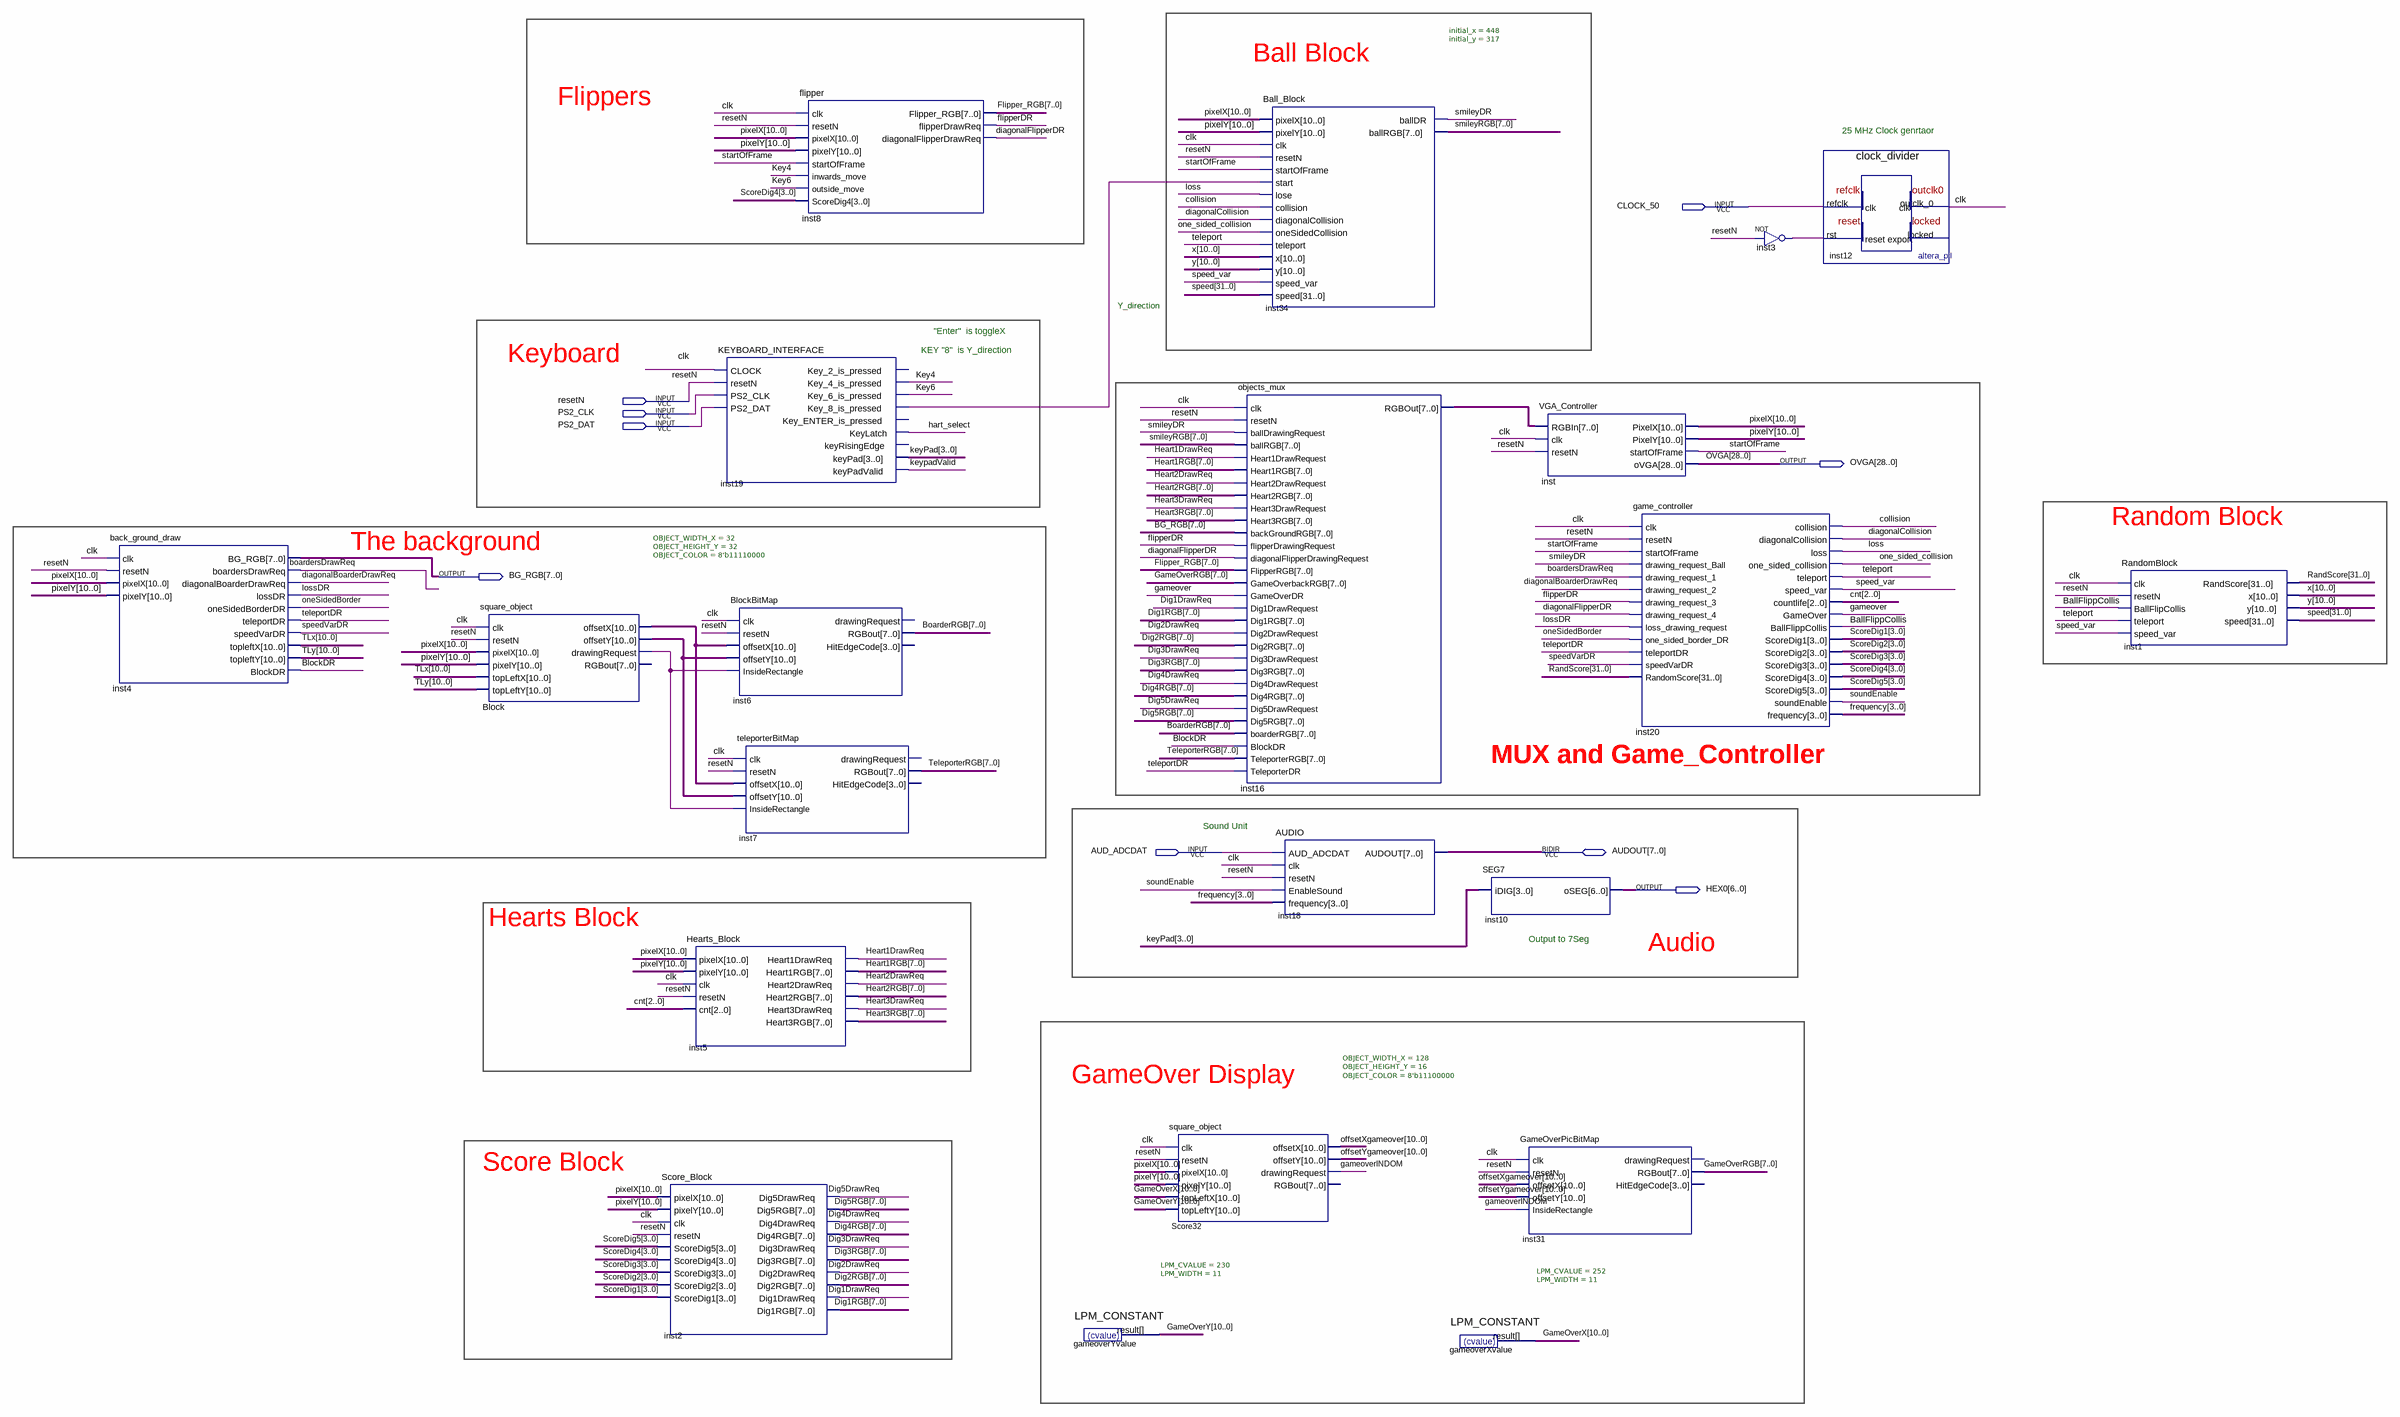
[diagram p0: schematic sheet]
// Quartus schematic TOP_VGA_DEMO_KBD.bdf as structural Verilog: 21 symbols, 9 pins
module TOP_VGA_DEMO_KBD (
  input  CLOCK_50,
  input  resetN,
  input  PS2_CLK,
  input  PS2_DAT,
  input  AUD_ADCDAT,
  inout  [7:0] AUDOUT,
  output [28:0] OVGA,
  output [7:0] BG_RGB,
  output [6:0] HEX0
);

  wire BallFlippCollis, Block_drawingrequest, BlockDR, boardersDrawReq, clk, collision,
       diagonalBoarderDrawReq, diagonalCollision, diagonalFlipperDR, Dig1DrawReq, Dig2DrawReq, Dig3DrawReq,
       Dig4DrawReq, Dig5DrawReq, flipperDR, gameover, gameoverINDOM, hart_select, Heart1DrawReq,
       Heart2DrawReq, Heart3DrawReq, inst3_out, inst19_key_8_is_pressed, Key4, Key6, keypadValid, loss,
       lossDR, one_sided_collision, oneSidedBorder, smileyDR, soundEnable, speed_var, speedVarDR,
       startOfFrame, teleport, teleportDR;
  wire [2:0] cnt;
  wire [3:0] frequency, keyPad, ScoreDig1, ScoreDig2, ScoreDig3, ScoreDig4, ScoreDig5;
  wire [7:0] BoarderRGB, Dig1RGB, Dig2RGB, Dig3RGB, Dig4RGB, Dig5RGB, Flipper_RGB, GameOverRGB, Heart1RGB,
       Heart2RGB, Heart3RGB, inst16_rgbout, smileyRGB, TeleporterRGB;
  wire [10:0] Block_offsetx, Block_offsety, GameOverX, GameOverY, offsetXgameover, offsetYgameover, pixelX,
       pixelY, TLx, TLy, x, y;
  wire [31:0] RandScore, speed;

  back_ground_draw inst4 (
    .clk(clk), .resetN(resetN), .pixelX(pixelX), .pixelY(pixelY), .BG_RGB(BG_RGB),
    .boardersDrawReq(boardersDrawReq), .diagonalBoarderDrawReq(diagonalBoarderDrawReq), .lossDR(lossDR),
    .oneSidedBorderDR(oneSidedBorder), .teleportDR(teleportDR), .speedVarDR(speedVarDR), .topleftX(TLx),
    .topleftY(TLy), .BlockDR(BlockDR));
  square_object #(.OBJECT_WIDTH_X(32), .OBJECT_HEIGHT_Y(32), .OBJECT_COLOR(8'b11110000)) Block (
    .clk(clk), .resetN(resetN), .pixelX(pixelX), .pixelY(pixelY), .topLeftX(TLx), .topLeftY(TLy),
    .offsetX(Block_offsetx), .offsetY(Block_offsety), .drawingRequest(Block_drawingrequest));  // open: RGBout
  Score_Block inst2 (
    .pixelX(pixelX), .pixelY(pixelY), .clk(clk), .resetN(resetN), .ScoreDig5(ScoreDig5),
    .ScoreDig4(ScoreDig4), .ScoreDig3(ScoreDig3), .ScoreDig2(ScoreDig2), .ScoreDig1(ScoreDig1),
    .Dig5DrawReq(Dig5DrawReq), .Dig5RGB(Dig5RGB), .Dig4DrawReq(Dig4DrawReq), .Dig4RGB(Dig4RGB),
    .Dig3DrawReq(Dig3DrawReq), .Dig3RGB(Dig3RGB), .Dig2DrawReq(Dig2DrawReq), .Dig2RGB(Dig2RGB),
    .Dig1DrawReq(Dig1DrawReq), .Dig1RGB(Dig1RGB));
  Hearts_Block inst5 (
    .pixelX(pixelX), .pixelY(pixelY), .clk(clk), .resetN(resetN), .cnt(cnt), .Heart1DrawReq(Heart1DrawReq),
    .Heart1RGB(Heart1RGB), .Heart2DrawReq(Heart2DrawReq), .Heart2RGB(Heart2RGB),
    .Heart3DrawReq(Heart3DrawReq), .Heart3RGB(Heart3RGB));
  KEYBOARD_INTERFACE inst19 (
    .CLOCK(clk), .resetN(resetN), .PS2_CLK(PS2_CLK), .PS2_DAT(PS2_DAT), .Key_4_is_pressed(Key4),
    .Key_6_is_pressed(Key6), .Key_8_is_pressed(inst19_key_8_is_pressed), .KeyLatch(hart_select),
    .keyPad(keyPad), .keyPadValid(keypadValid));  // open: Key_2_is_pressed, Key_ENTER_is_pressed, keyRisingEdge
  BlockBitMap inst6 (
    .clk(clk), .resetN(resetN), .offsetX(Block_offsetx), .offsetY(Block_offsety),
    .InsideRectangle(Block_drawingrequest), .RGBout(BoarderRGB));  // open: drawingRequest, HitEdgeCode
  teleporterBitMap inst7 (
    .clk(clk), .resetN(resetN), .offsetX(Block_offsetx), .offsetY(Block_offsety),
    .InsideRectangle(Block_drawingrequest), .RGBout(TeleporterRGB));  // open: drawingRequest, HitEdgeCode
  flipper inst8 (
    .clk(clk), .resetN(resetN), .pixelX(pixelX), .pixelY(pixelY), .startOfFrame(startOfFrame),
    .inwards_move(Key4), .outside_move(Key6), .ScoreDig4(ScoreDig4), .Flipper_RGB(Flipper_RGB),
    .flipperDrawReq(flipperDR), .diagonalFlipperDrawReq(diagonalFlipperDR));
  LPM_CONSTANT #(.LPM_CVALUE(230), .LPM_WIDTH(11)) gameoverYvalue (.result(GameOverY));
  square_object #(.OBJECT_WIDTH_X(128), .OBJECT_HEIGHT_Y(16), .OBJECT_COLOR(8'b11100000)) Score32 (
    .clk(clk), .resetN(resetN), .pixelX(pixelX), .pixelY(pixelY), .topLeftX(GameOverX), .topLeftY(GameOverY),
    .offsetX(offsetXgameover), .offsetY(offsetYgameover), .drawingRequest(gameoverINDOM));  // open: RGBout
  Ball_Block #(.initial_x(448), .initial_y(317)) inst34 (
    .pixelX(pixelX), .pixelY(pixelY), .clk(clk), .resetN(resetN), .startOfFrame(startOfFrame),
    .start(inst19_key_8_is_pressed), .lose(loss), .collision(collision),
    .diagonalCollision(diagonalCollision), .oneSidedCollision(one_sided_collision), .teleport(teleport),
    .x(x), .y(y), .speed_var(speed_var), .speed(speed), .ballDR(smileyDR), .ballRGB(smileyRGB));
  objects_mux inst16 (
    .clk(clk), .resetN(resetN), .ballDrawingRequest(smileyDR), .ballRGB(smileyRGB),
    .Heart1DrawRequest(Heart1DrawReq), .Heart1RGB(Heart1RGB), .Heart2DrawRequest(Heart2DrawReq),
    .Heart2RGB(Heart2RGB), .Heart3DrawRequest(Heart3DrawReq), .Heart3RGB(Heart3RGB), .backGroundRGB(BG_RGB),
    .flipperDrawingRequest(flipperDR), .diagonalFlipperDrawingRequest(diagonalFlipperDR),
    .FlipperRGB(Flipper_RGB), .GameOverbackRGB(GameOverRGB), .GameOverDR(gameover),
    .Dig1DrawRequest(Dig1DrawReq), .Dig1RGB(Dig1RGB), .Dig2DrawRequest(Dig2DrawReq), .Dig2RGB(Dig2RGB),
    .Dig3DrawRequest(Dig3DrawReq), .Dig3RGB(Dig3RGB), .Dig4DrawRequest(Dig4DrawReq), .Dig4RGB(Dig4RGB),
    .Dig5DrawRequest(Dig5DrawReq), .Dig5RGB(Dig5RGB), .boarderRGB(BoarderRGB), .BlockDR(BlockDR),
    .TeleporterRGB(TeleporterRGB), .TeleporterDR(teleportDR), .RGBOut(inst16_rgbout));
  AUDIO inst18 (
    .AUD_ADCDAT(AUD_ADCDAT), .clk(clk), .resetN(resetN), .EnableSound(soundEnable), .frequency(frequency),
    .AUDOUT(AUDOUT));
  LPM_CONSTANT #(.LPM_CVALUE(252), .LPM_WIDTH(11)) gameoverXvalue (.result(GameOverX));
  SEG7 inst10 (.iDIG(keyPad), .oSEG(HEX0));
  VGA_Controller inst (
    .RGBIn(inst16_rgbout), .clk(clk), .resetN(resetN), .PixelX(pixelX), .PixelY(pixelY),
    .startOfFrame(startOfFrame), .oVGA(OVGA));
  GameOverPicBitMap inst31 (
    .clk(clk), .resetN(resetN), .offsetX(offsetXgameover), .offsetY(offsetYgameover),
    .InsideRectangle(gameoverINDOM), .RGBout(GameOverRGB));  // open: drawingRequest, HitEdgeCode
  game_controller inst20 (
    .clk(clk), .resetN(resetN), .startOfFrame(startOfFrame), .drawing_request_Ball(smileyDR),
    .drawing_request_1(boardersDrawReq), .drawing_request_2(diagonalBoarderDrawReq),
    .drawing_request_3(flipperDR), .drawing_request_4(diagonalFlipperDR), .loss_drawing_request(lossDR),
    .one_sided_border_DR(oneSidedBorder), .teleportDR(teleportDR), .speedVarDR(speedVarDR),
    .RandomScore(RandScore), .collision(collision), .diagonalCollision(diagonalCollision), .loss(loss),
    .one_sided_collision(one_sided_collision), .teleport(teleport), .speed_var(speed_var), .countlife(cnt),
    .GameOver(gameover), .BallFlippCollis(BallFlippCollis), .ScoreDig1(ScoreDig1), .ScoreDig2(ScoreDig2),
    .ScoreDig3(ScoreDig3), .ScoreDig4(ScoreDig4), .ScoreDig5(ScoreDig5), .soundEnable(soundEnable),
    .frequency(frequency));
  not inst3 (inst3_out, resetN);
  clock_divider inst12 (.refclk(CLOCK_50), .rst(inst3_out), .outclk_0(clk));  // open: locked
  RandomBlock inst1 (
    .clk(clk), .resetN(resetN), .BallFlipCollis(BallFlippCollis), .teleport(teleport), .speed_var(speed_var),
    .RandScore(RandScore), .x(x), .y(y), .speed(speed));

  // Notes on the sheet:
  //   Ball Block
  //   Flippers
  //   25 MHz Clock genrtaor
  //   Y_direction
  //   "Enter"  is toggleX
  //   Keyboard
  //   KEY "8"  is Y_direction
  //   Random Block
  //   The background
  //   MUX and Game_Controller
  //   Sound Unit
  //   Hearts Block
  //   Audio
  //   Output to 7Seg
  //   GameOver Display
  //   Score Block
endmodule
